# EAGLE schematic main (EAGLE 8.3.2)
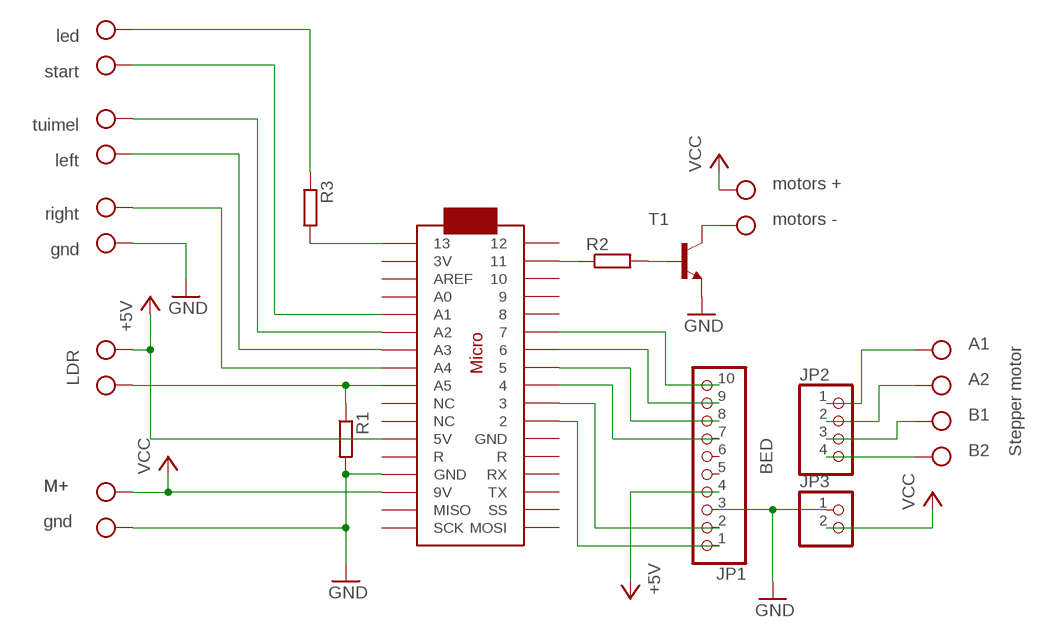
[diagram p0: schematic, sheet 1]

## Parts
JP1  PINHD-1X10  [1X10]
JP2  PINHD-1X4  [1X04]
JP3  PINHD-1X2  [1X02]
R1  R-EU_0207/10  [0207/10]
R2  R-EU_0207/10  [0207/10]
R3  R-EU_0207/10  [0207/10]
T1  BD239  [TO220]
U$1  ARDUINOMICRO  [ARDUINOMICRO]
X1  W237-102  [W237-102]
X2  W237-102  [W237-102]
X3  W237-102  [W237-102]
X4  W237-102  [W237-102]
X5  W237-102  [W237-102]
X6  W237-102  [W237-102]
X7  W237-102  [W237-102]
X8  W237-102  [W237-102]

## Nets
+5V: JP1.4 U$1.P$23(5V) X7.2
GND: JP1.3 JP3.1 R1.2 T1.3(E) U$1.P$12(GND) X3.1 X6.2
N$1: R2.1 U$1.P$2
N$2: JP1.1 U$1.P$11
N$3: JP1.2 U$1.P$10
N$4: JP1.10 U$1.P$6
N$5: JP2.4 X2.2
N$6: JP2.3 X2.1
N$7: JP2.2 X1.2
N$8: JP2.1 X1.1
N$9: U$1.P$29(A2) X5.1
N$10: U$1.P$30(A1) X4.2
N$11: R2.2 T1.1(B)
N$12: R3.2 U$1.P$34
N$13: R1.1 U$1.P$26(A5) X7.1
N$14: T1.2(C) X8.2
N$15: U$1.P$27(A4) X6.1
N$16: R3.1 X4.1
N$17: U$1.P$28(A3) X5.2
N$19: JP1.9 U$1.P$7
N$20: JP1.8 U$1.P$8
N$21: JP1.7 U$1.P$9
VCC: JP3.2 U$1.P$20(9V) X3.2 X8.1
Unconnected: JP1.5 JP1.6 U$1.P$1 U$1.P$3 U$1.P$4 U$1.P$5 U$1.P$13(R) U$1.P$14(RX) U$1.P$15(TX) U$1.P$16(SS) U$1.P$17(MOSI) U$1.P$18(SCK) U$1.P$19(MISO) U$1.P$21(GND) U$1.P$22(R) U$1.P$24(NC) U$1.P$25(NC) U$1.P$31(A0) U$1.P$32(AREF) U$1.P$33(3V)

## Notes on the sheet
- led
- start
- tuimel
- left
- motors +
- right
- motors -
- gnd
- A1
- LDR | A2
- B1
- B2 | Stepper motor
- BED
- M+ | M+
- gnd

## Library data of the parts
JP1 = pinhead:PINHD-1X10: PIN HEADER
JP2 = pinhead:PINHD-1X4: PIN HEADER
JP3 = pinhead:PINHD-1X2: PIN HEADER
R1-R3 = rcl:R-EU_: RESISTOR, European symbol
T1 = transistor-neu-to92:BD239: NPN TRANSISTOR Source: http://www.fairchildsemi.com/ds/BD/BD239C.pdf
U$1 = adafruit:ARDUINOMICRO
X1-X8 = con-wago-500:W237-102: WAGO SCREW CLAMP; MPN: 237-102; OC_FARNELL: unknown; OC_NEWARK: 70K9898